# Altium schematic sheet Regulator.SchDoc
size A
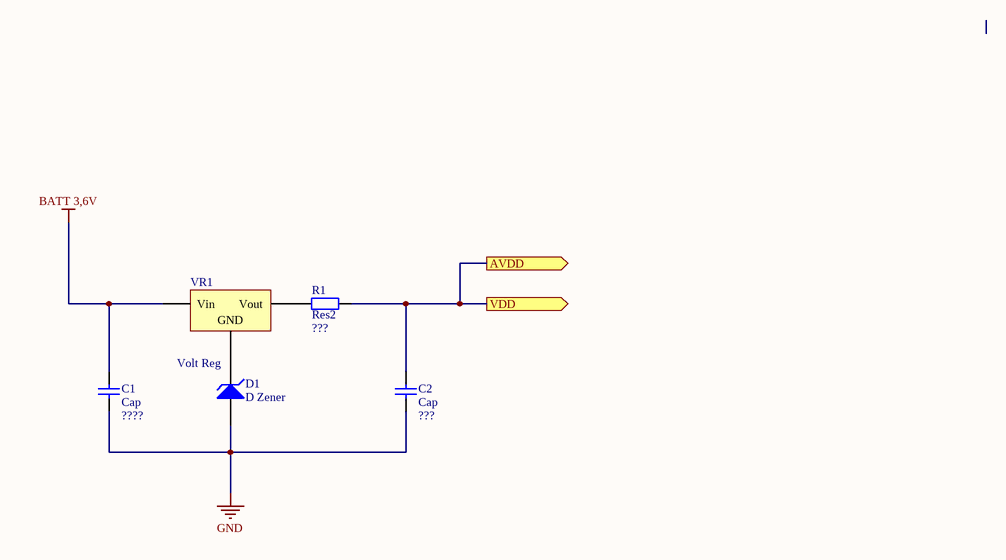
[diagram p0: Regulator.SchDoc]

## Parts
C1  Cap  value ????  [RAD-0.3]
C2  Cap  value ???  [RAD-0.3]
D1  D Zener  [DIODE-0.7]
R1  Res2  value ???  [AXIAL-0.4]
VR1  Volt Reg  [D2PAK_N]

## Ports
AVDD (out), VDD (out)

## Nets
BATT 3,6V: C1.2 VR1.1(Vin)
GND: C1.1 C2.1 D1.1(A)
AVDD: C2.2 R1.2 ; port AVDD, port VDD
NetD1_2: D1.2(K) VR1.2(GND)
NetR1_1: R1.1 VR1.3(Vout)

## Library data of the parts
C1 C2 = Cap: Capacitor; Published: 8-Jun-2000; LatestRevisionDate: 17-Jul-2002; LatestRevisionNote: Re-released for DXP Platform.; PackageReference: RAD-0.3; Publisher: Altium Limited; PackageDescription: Radial Cap, Thru-Hole; 2 Leads; 0.3 in Pin Spacing
D1 = D Zener: Zener Diode; Published: 8-Jun-2000; LatestRevisionDate: 17-Jul-2002; LatestRevisionNote: Re-released for DXP Platform.; PackageReference: DIODE-0.7; Publisher: Altium Limited; PackageDescription: Diode, Thru-Hole; 2 Leads; 0.7 in Pin Spacing
R1 = Res2: Resistor; Published: 8-Jun-2000; LatestRevisionDate: 17-Jul-2002; LatestRevisionNote: Re-released for DXP Platform.; PackageReference: AXIAL-0.4; Publisher: Altium Limited; PackageDescription: Axial Device, Thru-Hole; 2 Leads; 0.4 in Pin Spacing
VR1 = Volt Reg: Voltage Regulator; Published: 24-Mar-1999; LatestRevisionDate: 29-May-2009; LatestRevisionNote: IPC-7351 Footprint Added.; PackageReference: D2PAK; Publisher: Altium Limited; PackageDescription: 3-Pin Transistor Outline Package 2.54 mm Pitch, 15.1 mm Lead Span